# Altium project pyboardCN_V2.PrjPCB
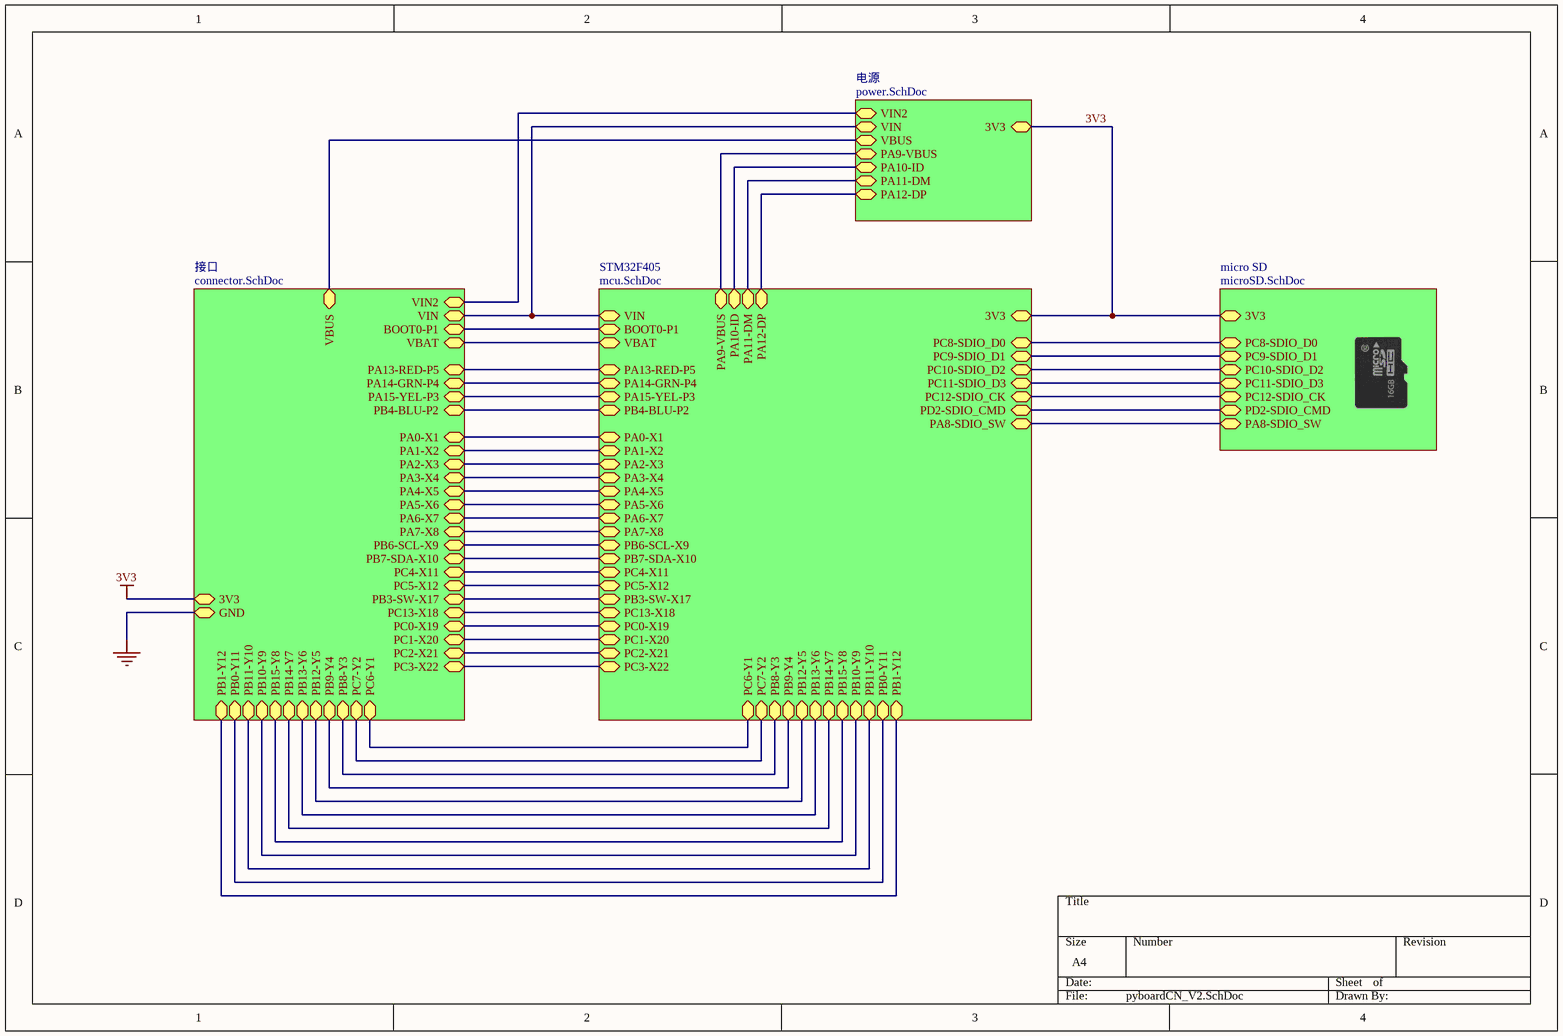
[diagram p0: pyboardCN_V2.SchDoc]
5 sheets, 62 parts. Net scope: hierarchical (ports join the sheet entries above them; power ports are global).
Board file: pyboardCN_V2.PcbDoc
Sheets:
  pyboardCN_V2.SchDoc
    STM32F405 = mcu.SchDoc
    接口 = connector.SchDoc
    电源 = power.SchDoc
    micro SD = microSD.SchDoc

## Sheet pyboardCN_V2.SchDoc
size A4

### Sub-sheets
micro SD = microSD.SchDoc: PC8-SDIO_D0, PC9-SDIO_D1, PC10-SDIO_D2, PC11-SDIO_D3, PC12-SDIO_CK, PD2-SDIO_CMD, PA8-SDIO_SW, 3V3
STM32F405 = mcu.SchDoc: PC8-SDIO_D0, PC9-SDIO_D1, PC10-SDIO_D2, PC11-SDIO_D3, PC12-SDIO_CK, PD2-SDIO_CMD, PA8-SDIO_SW, VIN, PA9-VBUS, PA10-ID, PA11-DM, PA12-DP, PA0-X1, PA1-X2, PA2-X3, PA3-X4, PA4-X5, PA5-X6, PA6-X7, PA7-X8, PB6-SCL-X9, PB7-SDA-X10, PC5-X12, PC4-X11, PB3-SW-X17, PC13-X18, PC0-X19, PC1-X20, PC2-X21, PC3-X22, PC6-Y1, PC7-Y2, PB8-Y3, PB9-Y4, PB12-Y5, PB13-Y6, PB14-Y7, PB15-Y8, PB10-Y9, PB11-Y10, PB0-Y11, PB1-Y12, BOOT0-P1, VBAT, PA13-RED-P5, PA14-GRN-P4, PA15-YEL-P3, PB4-BLU-P2, 3V3
接口 = connector.SchDoc: VIN, PC6-Y1, PC7-Y2, PB8-Y3, PB9-Y4, PB12-Y5, PB13-Y6, PB14-Y7, PB15-Y8, PB10-Y9, PB11-Y10, PB0-Y11, PB1-Y12, PA0-X1, PA1-X2, PA2-X3, PA3-X4, PA4-X5, PA5-X6, PA6-X7, PA7-X8, PB6-SCL-X9, PB7-SDA-X10, PC5-X12, PC4-X11, PB3-SW-X17, PC13-X18, PC0-X19, PC1-X20, PC2-X21, PC3-X22, BOOT0-P1, VBAT, PA13-RED-P5, PA14-GRN-P4, PA15-YEL-P3, PB4-BLU-P2, VIN2, 3V3, GND, VBUS
电源 = power.SchDoc: VIN, PA9-VBUS, PA10-ID, PA11-DM, PA12-DP, 3V3, VIN2, VBUS

### Nets
3V3: sheet STM32F405/3V3, sheet 接口/3V3, sheet 电源/3V3, sheet micro SD/3V3
VBUS: sheet 接口/VBUS, sheet 电源/VBUS
VIN: sheet STM32F405/VIN, sheet 接口/VIN, sheet 电源/VIN
BOOT0-P1: sheet STM32F405/BOOT0-P1, sheet 接口/BOOT0-P1
PA0-X1: sheet STM32F405/PA0-X1, sheet 接口/PA0-X1
PA1-X2: sheet STM32F405/PA1-X2, sheet 接口/PA1-X2
PA2-X3: sheet STM32F405/PA2-X3, sheet 接口/PA2-X3
PA3-X4: sheet STM32F405/PA3-X4, sheet 接口/PA3-X4
PA4-X5: sheet STM32F405/PA4-X5, sheet 接口/PA4-X5
PA5-X6: sheet STM32F405/PA5-X6, sheet 接口/PA5-X6
PA6-X7: sheet STM32F405/PA6-X7, sheet 接口/PA6-X7
PA7-X8: sheet STM32F405/PA7-X8, sheet 接口/PA7-X8
PA8-SDIO_SW: sheet STM32F405/PA8-SDIO_SW, sheet micro SD/PA8-SDIO_SW
PA9-VBUS: sheet STM32F405/PA9-VBUS, sheet 电源/PA9-VBUS
PA10-ID: sheet STM32F405/PA10-ID, sheet 电源/PA10-ID
PA11-DM: sheet STM32F405/PA11-DM, sheet 电源/PA11-DM
PA12-DP: sheet STM32F405/PA12-DP, sheet 电源/PA12-DP
PA13-RED-P5: sheet STM32F405/PA13-RED-P5, sheet 接口/PA13-RED-P5
PA14-GRN-P4: sheet STM32F405/PA14-GRN-P4, sheet 接口/PA14-GRN-P4
PA15-YEL-P3: sheet STM32F405/PA15-YEL-P3, sheet 接口/PA15-YEL-P3
PB0-Y11: sheet STM32F405/PB0-Y11, sheet 接口/PB0-Y11
PB1-Y12: sheet STM32F405/PB1-Y12, sheet 接口/PB1-Y12
PB3-SW-X17: sheet STM32F405/PB3-SW-X17, sheet 接口/PB3-SW-X17
PB4-BLU-P2: sheet STM32F405/PB4-BLU-P2, sheet 接口/PB4-BLU-P2
PB6-SCL-X9: sheet STM32F405/PB6-SCL-X9, sheet 接口/PB6-SCL-X9
PB7-SDA-X10: sheet STM32F405/PB7-SDA-X10, sheet 接口/PB7-SDA-X10
PB8-Y3: sheet STM32F405/PB8-Y3, sheet 接口/PB8-Y3
PB9-Y4: sheet STM32F405/PB9-Y4, sheet 接口/PB9-Y4
PB10-Y9: sheet STM32F405/PB10-Y9, sheet 接口/PB10-Y9
PB11-Y10: sheet STM32F405/PB11-Y10, sheet 接口/PB11-Y10
PB12-Y5: sheet STM32F405/PB12-Y5, sheet 接口/PB12-Y5
PB13-Y6: sheet STM32F405/PB13-Y6, sheet 接口/PB13-Y6
PB14-Y7: sheet STM32F405/PB14-Y7, sheet 接口/PB14-Y7
PB15-Y8: sheet STM32F405/PB15-Y8, sheet 接口/PB15-Y8
PC0-X19: sheet STM32F405/PC0-X19, sheet 接口/PC0-X19
PC1-X20: sheet STM32F405/PC1-X20, sheet 接口/PC1-X20
PC2-X21: sheet STM32F405/PC2-X21, sheet 接口/PC2-X21
PC3-X22: sheet STM32F405/PC3-X22, sheet 接口/PC3-X22
PC4-X11: sheet STM32F405/PC4-X11, sheet 接口/PC4-X11
PC5-X12: sheet STM32F405/PC5-X12, sheet 接口/PC5-X12
PC6-Y1: sheet STM32F405/PC6-Y1, sheet 接口/PC6-Y1
PC7-Y2: sheet STM32F405/PC7-Y2, sheet 接口/PC7-Y2
PC8-SDIO_D0: sheet STM32F405/PC8-SDIO_D0, sheet micro SD/PC8-SDIO_D0
PC9-SDIO_D1: sheet STM32F405/PC9-SDIO_D1, sheet micro SD/PC9-SDIO_D1
PC10-SDIO_D2: sheet STM32F405/PC10-SDIO_D2, sheet micro SD/PC10-SDIO_D2
PC11-SDIO_D3: sheet STM32F405/PC11-SDIO_D3, sheet micro SD/PC11-SDIO_D3
PC12-SDIO_CK: sheet STM32F405/PC12-SDIO_CK, sheet micro SD/PC12-SDIO_CK
PC13-X18: sheet STM32F405/PC13-X18, sheet 接口/PC13-X18
PD2-SDIO_CMD: sheet STM32F405/PD2-SDIO_CMD, sheet micro SD/PD2-SDIO_CMD
VBAT: sheet STM32F405/VBAT, sheet 接口/VBAT
VIN2: sheet 接口/VIN2, sheet 电源/VIN2

## Sheet mcu.SchDoc
size A3
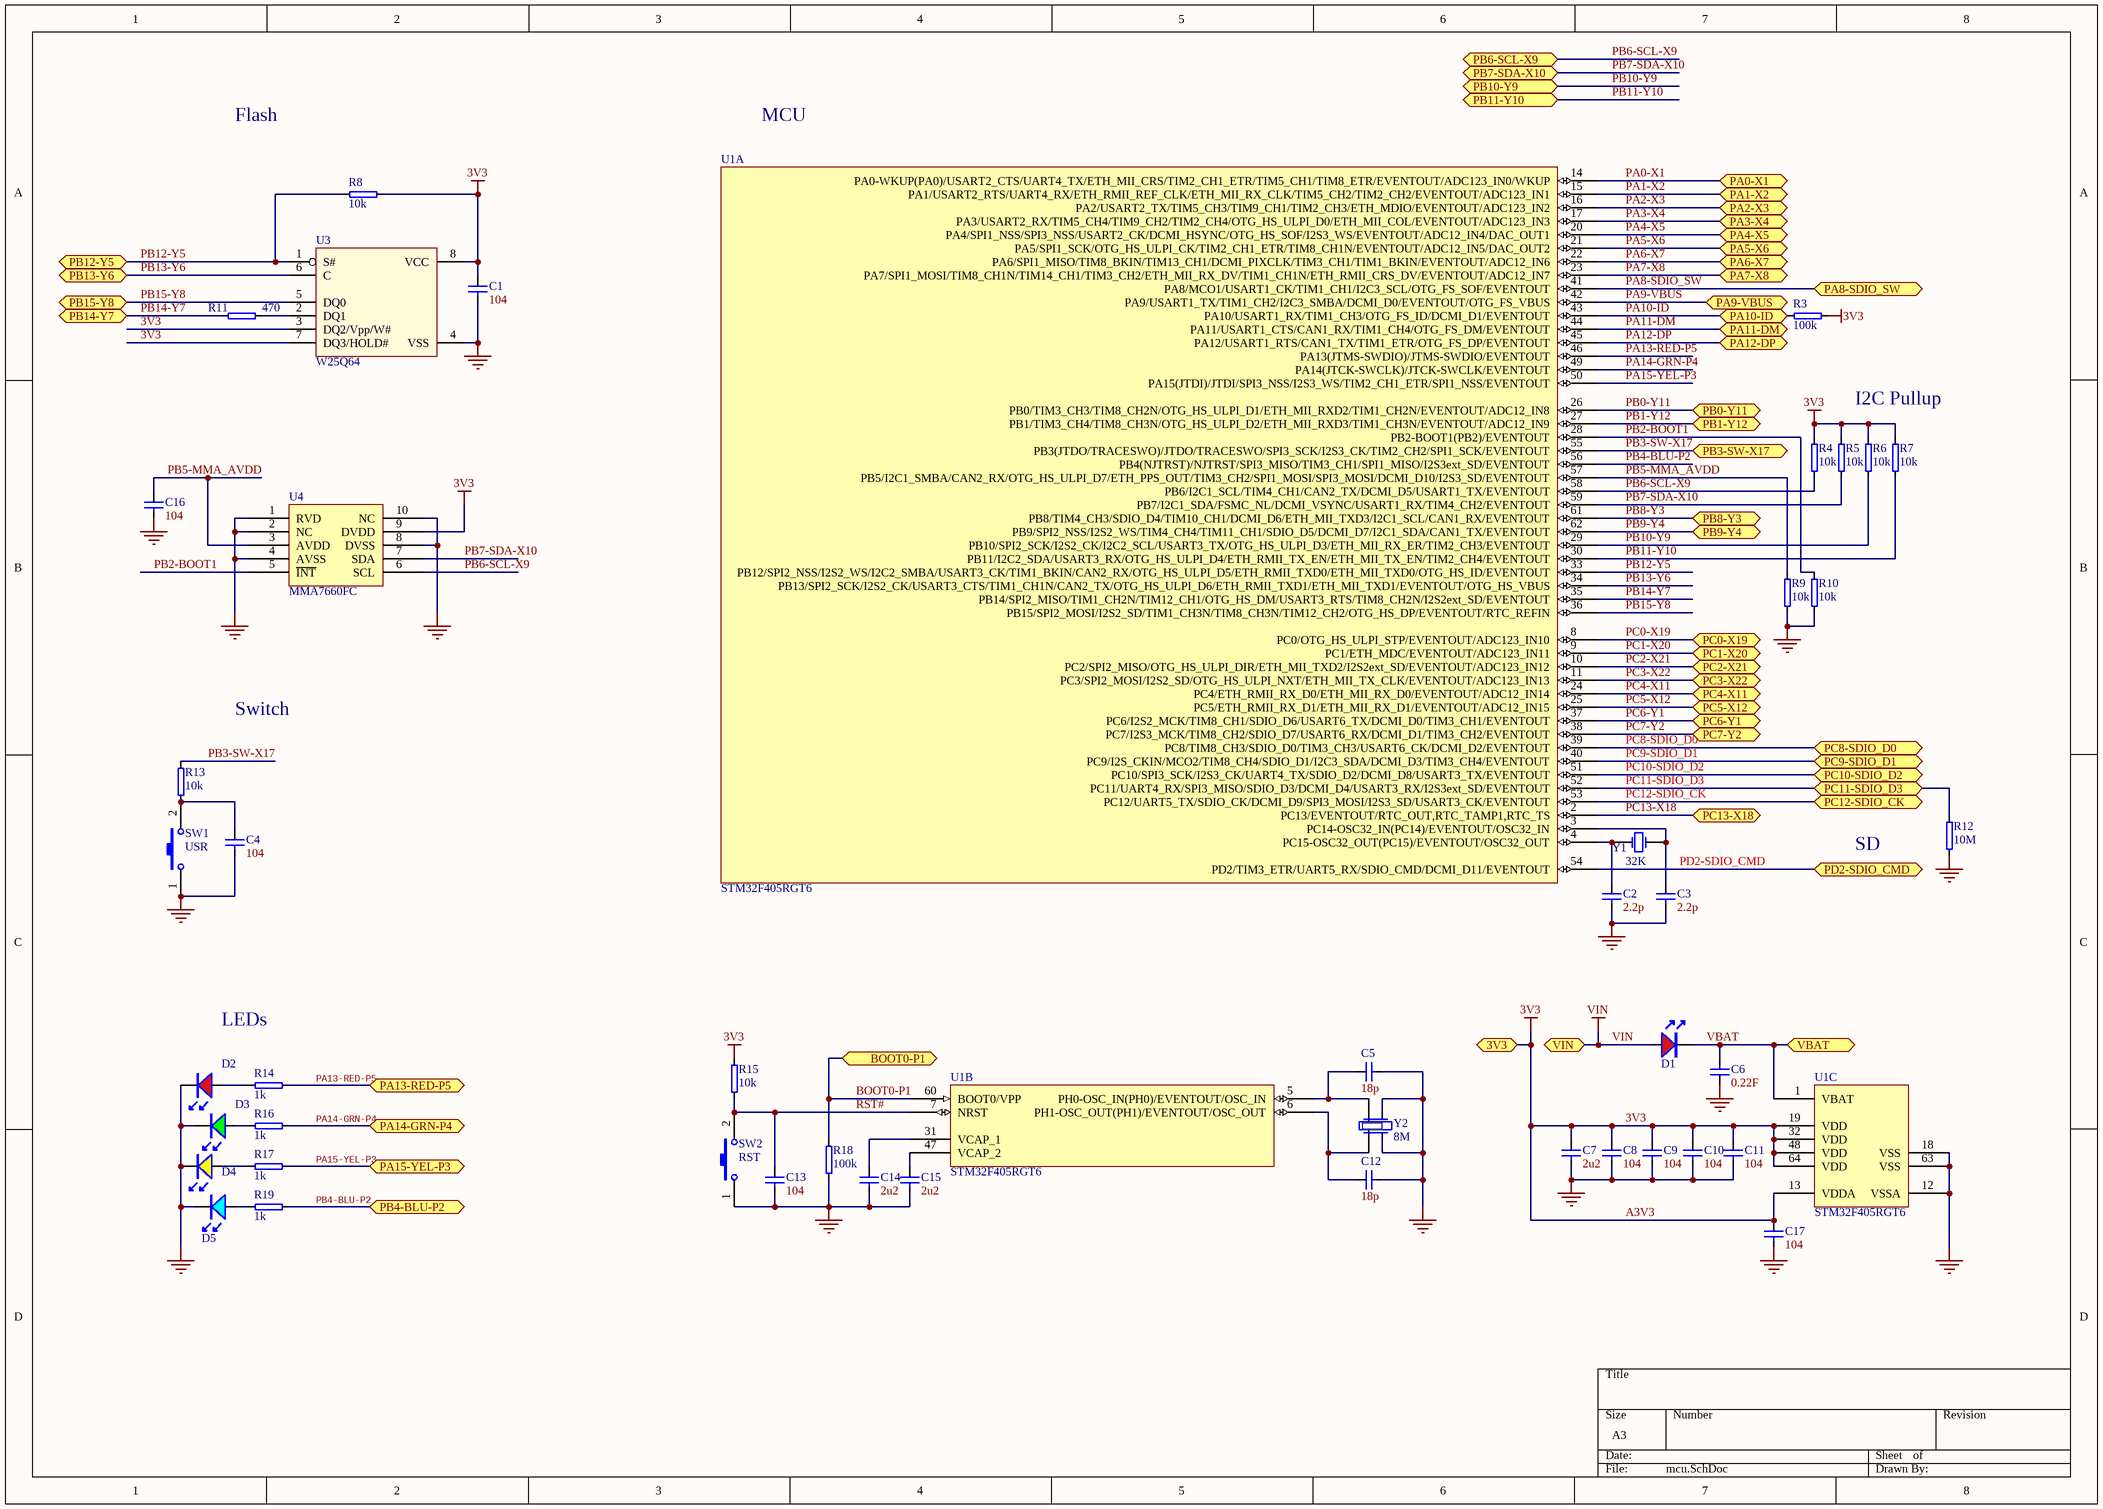
[diagram p1: mcu.SchDoc]

### Parts
C1  104  [SMD0402]
C2  2.2p  [SMD0402]
C3  2.2p  [SMD0402]
C4  104  [SMD0402]
C5  18p  [SMD0402]
C6  0.22F  [DMS3R3224R]
C7  2u2  [SMD0603]
C8  104  [SMD0402]
C9  104  [SMD0402]
C10  104  [SMD0402]
C11  104  [SMD0402]
C12  18p  [SMD0402]
C13  104  [SMD0402]
C14  2u2  [SMD0603]
C15  2u2  [SMD0603]
C16  104  [SMD0402]
C17  104  [SMD0402]
D1  LED RED  [LED_0603_RED]  (value not drawn)
D2  LED RED  [LED_0603_RED]  (value not drawn)
D3  LED GREEN  [LED_0603_GREEN]  (value not drawn)
D4  LED Yellow  [LED_0603_YELLOW]  (value not drawn)
D5  LED Blue  [LED_0603_BLUE]  (value not drawn)
R3  100k  [SMD0402]
R4  10k  [SMD0402]
R5  10k  [SMD0402]
R6  10k  [SMD0402]
R7  10k  [SMD0402]
R8  10k  [SMD0402]
R9  10k  [SMD0402]
R10  10k  [SMD0402]
R11  470  [SMD0402]
R12  10M  [SMD0402]
R13  10k  [SMD0402]
R14  1k  [SMD0402]
R15  10k  [SMD0402]
R16  1k  [SMD0402]
R17  1k  [SMD0402]
R18  100k  [SMD0402]
R19  1k  [SMD0402]
SW1  USR  [SWPB_2x4_L]
SW2  RST  [SWPB_2x4_L]
U1  STM32F405RGT6  [LQFP64_M]  (parts A,B,C of 3)
U3  W25Q64  [SO8_L]
U4  MMA7660FC  [MMA7660]
Y1  32K  [TXC_9H03200019]
Y2  8M  [SMD3225]

### Ports
3V3, BOOT0-P1, PA0-X1, PA1-X2, PA2-X3, PA3-X4, PA4-X5, PA5-X6, PA6-X7, PA7-X8, PA8-SDIO_SW, PA9-VBUS, PA10-ID, PA11-DM, PA12-DP, PA13-RED-P5, PA14-GRN-P4, PA15-YEL-P3, PB0-Y11, PB1-Y12, PB3-SW-X17, PB4-BLU-P2, PB6-SCL-X9, PB7-SDA-X10, PB8-Y3, PB9-Y4, PB10-Y9, PB11-Y10, PB12-Y5, PB13-Y6, PB14-Y7, PB15-Y8, PC0-X19, PC1-X20, PC2-X21, PC3-X22, PC4-X11, PC5-X12, PC6-Y1, PC7-Y2, PC8-SDIO_D0, PC9-SDIO_D1, PC10-SDIO_D2, PC11-SDIO_D3, PC12-SDIO_CK, PC13-X18, PD2-SDIO_CMD, VBAT, VIN

### Nets
3V3: C1.2 C7.2 C8.2 C9.2 C10.2 C11.2 C17.2 R3.1 R4.1 R5.1 R6.1 R7.1 R8.1 R15.2 U1.13(VDDA) U1.19(VDD) U1.32(VDD) U1.48(VDD) U1.64(VDD) U3.3(DQ2/Vpp/W#) U3.7(DQ3/HOLD#) U3.8(VCC) U4.9(DVDD) ; port 3V3  [also labelled A3V3]
GND: C1.1 C2.1 C3.1 C4.1 C5.1 C6.2 C7.1 C8.1 C9.1 C10.1 C11.1 C12.1 C13.1 C14.1 C15.1 C16.1 C17.1 D2.2 D3.2 D4.2 D5.2 R9.2 R10.2 R12.2 R18.1 SW1.1 SW2.1 U1.12(VSSA) U1.18(VSS) U1.63(VSS) U3.4(VSS) U4.1(RVD) U4.2(NC) U4.4(AVSS) U4.8(DVSS) U4.10(NC) Y2.2(GND) Y2.4(GND)
VIN: D1.1 ; port VIN
BOOT0-P1: R18.2 U1.60(BOOT0/VPP) ; port BOOT0-P1
PA0-X1: U1.14(PA0-WKUP(PA0)/USART2_CTS/UART4_TX/ETH_MII_CRS/TIM2_CH1_ETR/TIM5_CH1/TIM8_ETR/EVENTOUT/ADC123_IN0/WKUP) ; port PA0-X1
PA1-X2: U1.15(PA1/USART2_RTS/UART4_RX/ETH_RMII_REF_CLK/ETH_MII_RX_CLK/TIM5_CH2/TIM2_CH2/EVENTOUT/ADC123_IN1) ; port PA1-X2
PA2-X3: U1.16(PA2/USART2_TX/TIM5_CH3/TIM9_CH1/TIM2_CH3/ETH_MDIO/EVENTOUT/ADC123_IN2) ; port PA2-X3
PA3-X4: U1.17(PA3/USART2_RX/TIM5_CH4/TIM9_CH2/TIM2_CH4/OTG_HS_ULPI_D0/ETH_MII_COL/EVENTOUT/ADC123_IN3) ; port PA3-X4
PA4-X5: U1.20(PA4/SPI1_NSS/SPI3_NSS/USART2_CK/DCMI_HSYNC/OTG_HS_SOF/I2S3_WS/EVENTOUT/ADC12_IN4/DAC_OUT1) ; port PA4-X5
PA5-X6: U1.21(PA5/SPI1_SCK/OTG_HS_ULPI_CK/TIM2_CH1_ETR/TIM8_CH1N/EVENTOUT/ADC12_IN5/DAC_OUT2) ; port PA5-X6
PA6-X7: U1.22(PA6/SPI1_MISO/TIM8_BKIN/TIM13_CH1/DCMI_PIXCLK/TIM3_CH1/TIM1_BKIN/EVENTOUT/ADC12_IN6) ; port PA6-X7
PA7-X8: U1.23(PA7/SPI1_MOSI/TIM8_CH1N/TIM14_CH1/TIM3_CH2/ETH_MII_RX_DV/TIM1_CH1N/ETH_RMII_CRS_DV/EVENTOUT/ADC12_IN7) ; port PA7-X8
PA8-SDIO_SW: U1.41(PA8/MCO1/USART1_CK/TIM1_CH1/I2C3_SCL/OTG_FS_SOF/EVENTOUT) ; port PA8-SDIO_SW
PA9-VBUS: U1.42(PA9/USART1_TX/TIM1_CH2/I2C3_SMBA/DCMI_D0/EVENTOUT/OTG_FS_VBUS) ; port PA9-VBUS
PA10-ID: R3.2 U1.43(PA10/USART1_RX/TIM1_CH3/OTG_FS_ID/DCMI_D1/EVENTOUT) ; port PA10-ID
PA11-DM: U1.44(PA11/USART1_CTS/CAN1_RX/TIM1_CH4/OTG_FS_DM/EVENTOUT) ; port PA11-DM
PA12-DP: U1.45(PA12/USART1_RTS/CAN1_TX/TIM1_ETR/OTG_FS_DP/EVENTOUT) ; port PA12-DP
PA13-RED-P5: R14.1 U1.46(PA13(JTMS-SWDIO)/JTMS-SWDIO/EVENTOUT) ; port PA13-RED-P5
PA14-GRN-P4: R16.1 U1.49(PA14(JTCK-SWCLK)/JTCK-SWCLK/EVENTOUT) ; port PA14-GRN-P4
PA15-YEL-P3: R17.1 U1.50(PA15(JTDI)/JTDI/SPI3_NSS/I2S3_WS/TIM2_CH1_ETR/SPI1_NSS/EVENTOUT) ; port PA15-YEL-P3
PB0-Y11: U1.26(PB0/TIM3_CH3/TIM8_CH2N/OTG_HS_ULPI_D1/ETH_MII_RXD2/TIM1_CH2N/EVENTOUT/ADC12_IN8) ; port PB0-Y11
PB1-Y12: U1.27(PB1/TIM3_CH4/TIM8_CH3N/OTG_HS_ULPI_D2/ETH_MII_RXD3/TIM1_CH3N/EVENTOUT/ADC12_IN9) ; port PB1-Y12
PB2-BOOT1: R10.1 U1.28(PB2-BOOT1(PB2)/EVENTOUT) U4.5(~{INT})
PB3-SW-X17: R13.2 U1.55(PB3(JTDO/TRACESWO)/JTDO/TRACESWO/SPI3_SCK/I2S3_CK/TIM2_CH2/SPI1_SCK/EVENTOUT) ; port PB3-SW-X17
PB4-BLU-P2: R19.1 U1.56(PB4(NJTRST)/NJTRST/SPI3_MISO/TIM3_CH1/SPI1_MISO/I2S3ext_SD/EVENTOUT) ; port PB4-BLU-P2
PB5-MMA_AVDD: C16.2 R9.1 U1.57(PB5/I2C1_SMBA/CAN2_RX/OTG_HS_ULPI_D7/ETH_PPS_OUT/TIM3_CH2/SPI1_MOSI/SPI3_MOSI/DCMI_D10/I2S3_SD/EVENTOUT) U4.3(AVDD)
PB6-SCL-X9: R4.2 U1.58(PB6/I2C1_SCL/TIM4_CH1/CAN2_TX/DCMI_D5/USART1_TX/EVENTOUT) U4.6(SCL) ; port PB6-SCL-X9
PB7-SDA-X10: R5.2 U1.59(PB7/I2C1_SDA/FSMC_NL/DCMI_VSYNC/USART1_RX/TIM4_CH2/EVENTOUT) U4.7(SDA) ; port PB7-SDA-X10
PB8-Y3: U1.61(PB8/TIM4_CH3/SDIO_D4/TIM10_CH1/DCMI_D6/ETH_MII_TXD3/I2C1_SCL/CAN1_RX/EVENTOUT) ; port PB8-Y3
PB9-Y4: U1.62(PB9/SPI2_NSS/I2S2_WS/TIM4_CH4/TIM11_CH1/SDIO_D5/DCMI_D7/I2C1_SDA/CAN1_TX/EVENTOUT) ; port PB9-Y4
PB10-Y9: R6.2 U1.29(PB10/SPI2_SCK/I2S2_CK/I2C2_SCL/USART3_TX/OTG_HS_ULPI_D3/ETH_MII_RX_ER/TIM2_CH3/EVENTOUT) ; port PB10-Y9
PB11-Y10: R7.2 U1.30(PB11/I2C2_SDA/USART3_RX/OTG_HS_ULPI_D4/ETH_RMII_TX_EN/ETH_MII_TX_EN/TIM2_CH4/EVENTOUT) ; port PB11-Y10
PB12-Y5: R8.2 U1.33(PB12/SPI2_NSS/I2S2_WS/I2C2_SMBA/USART3_CK/TIM1_BKIN/CAN2_RX/OTG_HS_ULPI_D5/ETH_RMII_TXD0/ETH_MII_TXD0/OTG_HS_ID/EVENTOUT) U3.1(S#) ; port PB12-Y5
PB13-Y6: U1.34(PB13/SPI2_SCK/I2S2_CK/USART3_CTS/TIM1_CH1N/CAN2_TX/OTG_HS_ULPI_D6/ETH_RMII_TXD1/ETH_MII_TXD1/EVENTOUT/OTG_HS_VBUS) U3.6(C) ; port PB13-Y6
PB14-Y7: R11.2 U1.35(PB14/SPI2_MISO/TIM1_CH2N/TIM12_CH1/OTG_HS_DM/USART3_RTS/TIM8_CH2N/I2S2ext_SD/EVENTOUT) ; port PB14-Y7
PB15-Y8: U1.36(PB15/SPI2_MOSI/I2S2_SD/TIM1_CH3N/TIM8_CH3N/TIM12_CH2/OTG_HS_DP/EVENTOUT/RTC_REFIN) U3.5(DQ0) ; port PB15-Y8
PC0-X19: U1.8(PC0/OTG_HS_ULPI_STP/EVENTOUT/ADC123_IN10) ; port PC0-X19
PC1-X20: U1.9(PC1/ETH_MDC/EVENTOUT/ADC123_IN11) ; port PC1-X20
PC2-X21: U1.10(PC2/SPI2_MISO/OTG_HS_ULPI_DIR/ETH_MII_TXD2/I2S2ext_SD/EVENTOUT/ADC123_IN12) ; port PC2-X21
PC3-X22: U1.11(PC3/SPI2_MOSI/I2S2_SD/OTG_HS_ULPI_NXT/ETH_MII_TX_CLK/EVENTOUT/ADC123_IN13) ; port PC3-X22
PC4-X11: U1.24(PC4/ETH_RMII_RX_D0/ETH_MII_RX_D0/EVENTOUT/ADC12_IN14) ; port PC4-X11
PC5-X12: U1.25(PC5/ETH_RMII_RX_D1/ETH_MII_RX_D1/EVENTOUT/ADC12_IN15) ; port PC5-X12
PC6-Y1: U1.37(PC6/I2S2_MCK/TIM8_CH1/SDIO_D6/USART6_TX/DCMI_D0/TIM3_CH1/EVENTOUT) ; port PC6-Y1
PC7-Y2: U1.38(PC7/I2S3_MCK/TIM8_CH2/SDIO_D7/USART6_RX/DCMI_D1/TIM3_CH2/EVENTOUT) ; port PC7-Y2
PC8-SDIO_D0: U1.39(PC8/TIM8_CH3/SDIO_D0/TIM3_CH3/USART6_CK/DCMI_D2/EVENTOUT) ; port PC8-SDIO_D0
PC9-SDIO_D1: U1.40(PC9/I2S_CKIN/MCO2/TIM8_CH4/SDIO_D1/I2C3_SDA/DCMI_D3/TIM3_CH4/EVENTOUT) ; port PC9-SDIO_D1
PC10-SDIO_D2: U1.51(PC10/SPI3_SCK/I2S3_CK/UART4_TX/SDIO_D2/DCMI_D8/USART3_TX/EVENTOUT) ; port PC10-SDIO_D2
PC11-SDIO_D3: R12.1 U1.52(PC11/UART4_RX/SPI3_MISO/SDIO_D3/DCMI_D4/USART3_RX/I2S3ext_SD/EVENTOUT) ; port PC11-SDIO_D3
PC12-SDIO_CK: U1.53(PC12/UART5_TX/SDIO_CK/DCMI_D9/SPI3_MOSI/I2S3_SD/USART3_CK/EVENTOUT) ; port PC12-SDIO_CK
PC13-X18: U1.2(PC13/EVENTOUT/RTC_OUT,RTC_TAMP1,RTC_TS) ; port PC13-X18
PD2-SDIO_CMD: U1.54(PD2/TIM3_ETR/UART5_RX/SDIO_CMD/DCMI_D11/EVENTOUT) ; port PD2-SDIO_CMD
RST#: C13.2 R15.1 SW2.2 U1.7(NRST)
VBAT: C6.1 D1.2 U1.1(VBAT) ; port VBAT
NetC2_2: C2.2 U1.4(PC15-OSC32_OUT(PC15)/EVENTOUT/OSC32_OUT) Y1.1(OSC1)
NetC3_2: C3.2 U1.3(PC14-OSC32_IN(PC14)/EVENTOUT/OSC32_IN) Y1.2(OSC2)
NetC4_2: C4.2 R13.1 SW1.2
NetC5_2: C5.2 U1.5(PH0-OSC_IN(PH0)/EVENTOUT/OSC_IN) Y2.3(OSC2)
NetC12_2: C12.2 U1.6(PH1-OSC_OUT(PH1)/EVENTOUT/OSC_OUT) Y2.1(OSC1)
NetC14_2: C14.2 U1.31(VCAP_1)
NetC15_2: C15.2 U1.47(VCAP_2)
NetD2_1: D2.1 R14.2
NetD3_1: D3.1 R16.2
NetD4_1: D4.1 R17.2
NetD5_1: D5.1 R19.2
NetR11_1: R11.1 U3.2(DQ1)

### Notes on the sheet
- Flash
- MCU
- I2C Pullup
- (near R13) Switch
- SD
- LEDs

### Library data of the parts
C1-C17 = Cap
D1 D2 = LED-RED: 红色发光二极管
D3 = LED-GREEN: 绿色发光二极管
D4 = LED-YELLOW: 黄色发光二极管
D5 = LED-BLUE: 蓝色发光二极管
R3-R19 = Res
SW1 SW2 = SW-PB: Switch; Published: 24-Mar-1999; LatestRevisionDate: 17-Jul-2002; LatestRevisionNote: Re-released for DXP Platform.; PackageReference: SPST-2; Publisher: Altium Limited; PackageDescription: Switch; 2 Leads
U3 = N25Q128A13EF840E: 128Mb, 3V, Multiple I/O Serial Flash Memory, Quad/Dual; Manuf_1: MICRON; Manuf_Part_2: N25Q256A13EF840E; Manuf_Part_3: N25Q512A13EF840E; ECCN_US/EU: 3A991/NEC; Order: N25Q128A13EF840F-ND; Provided: ST; Ref St: 9171973; Manuf_Part_1: N25Q128A13EF840E; Distrib: MICRON
U4 = MMA7660
Y1 = XTAL
Y2 = XTAL_SMD

## Sheet connector.SchDoc
size A4
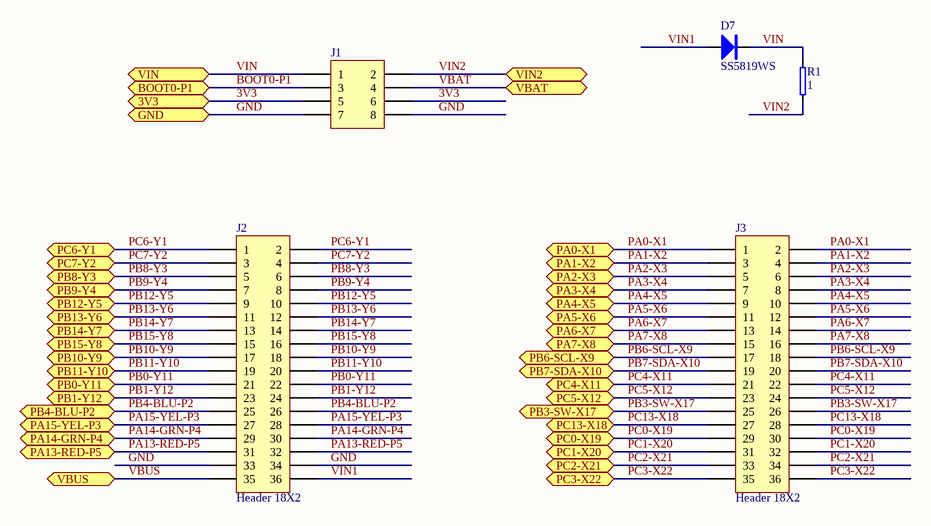
[diagram p2: connector.SchDoc]

### Parts
D7  SS5819WS  [1N5819-SOD323]
J1  (no value)  [HDR2X4]
J2  Header 18X2  [HDR2X18]
J3  Header 18X2  [HDR2X18]
R1  1  [SMD0402]

### Ports
3V3, BOOT0-P1, GND, PA0-X1, PA1-X2, PA2-X3, PA3-X4, PA4-X5, PA5-X6, PA6-X7, PA7-X8, PA13-RED-P5, PA14-GRN-P4, PA15-YEL-P3, PB0-Y11, PB1-Y12, PB3-SW-X17, PB4-BLU-P2, PB6-SCL-X9, PB7-SDA-X10, PB8-Y3, PB9-Y4, PB10-Y9, PB11-Y10, PB12-Y5, PB13-Y6, PB14-Y7, PB15-Y8, PC0-X19, PC1-X20, PC2-X21, PC3-X22, PC4-X11, PC5-X12, PC6-Y1, PC7-Y2, PC13-X18, VBAT, VBUS, VIN, VIN2

### Nets
3V3: J1.5 J1.6 ; port 3V3
GND: J1.7 J1.8 J2.33 J2.34 ; port GND
VBUS: J2.35 ; port VBUS
VIN: D7.2 J1.1 R1.1 ; port VIN
BOOT0-P1: J1.3 ; port BOOT0-P1
PA0-X1: J3.1 J3.2 ; port PA0-X1
PA1-X2: J3.3 J3.4 ; port PA1-X2
PA2-X3: J3.5 J3.6 ; port PA2-X3
PA3-X4: J3.7 J3.8 ; port PA3-X4
PA4-X5: J3.9 J3.10 ; port PA4-X5
PA5-X6: J3.11 J3.12 ; port PA5-X6
PA6-X7: J3.13 J3.14 ; port PA6-X7
PA7-X8: J3.15 J3.16 ; port PA7-X8
PA13-RED-P5: J2.31 J2.32 ; port PA13-RED-P5
PA14-GRN-P4: J2.29 J2.30 ; port PA14-GRN-P4
PA15-YEL-P3: J2.27 J2.28 ; port PA15-YEL-P3
PB0-Y11: J2.21 J2.22 ; port PB0-Y11
PB1-Y12: J2.23 J2.24 ; port PB1-Y12
PB3-SW-X17: J3.25 J3.26 ; port PB3-SW-X17
PB4-BLU-P2: J2.25 J2.26 ; port PB4-BLU-P2
PB6-SCL-X9: J3.17 J3.18 ; port PB6-SCL-X9
PB7-SDA-X10: J3.19 J3.20 ; port PB7-SDA-X10
PB8-Y3: J2.5 J2.6 ; port PB8-Y3
PB9-Y4: J2.7 J2.8 ; port PB9-Y4
PB10-Y9: J2.17 J2.18 ; port PB10-Y9
PB11-Y10: J2.19 J2.20 ; port PB11-Y10
PB12-Y5: J2.9 J2.10 ; port PB12-Y5
PB13-Y6: J2.11 J2.12 ; port PB13-Y6
PB14-Y7: J2.13 J2.14 ; port PB14-Y7
PB15-Y8: J2.15 J2.16 ; port PB15-Y8
PC0-X19: J3.29 J3.30 ; port PC0-X19
PC1-X20: J3.31 J3.32 ; port PC1-X20
PC2-X21: J3.33 J3.34 ; port PC2-X21
PC3-X22: J3.35 J3.36 ; port PC3-X22
PC4-X11: J3.21 J3.22 ; port PC4-X11
PC5-X12: J3.23 J3.24 ; port PC5-X12
PC6-Y1: J2.1 J2.2 ; port PC6-Y1
PC7-Y2: J2.3 J2.4 ; port PC7-Y2
PC13-X18: J3.27 J3.28 ; port PC13-X18
VBAT: J1.4 ; port VBAT
VIN1: D7.1 J2.36
VIN2: J1.2 R1.2 ; port VIN2

### Library data of the parts
D7 = Diode
J1 = Header 4X2: Header, 4-Pin, Dual row; LatestRevisionDate: 17-Jul-2002; LatestRevisionNote: Re-released for DXP Platform.; Publisher: Altium Limited
J2 J3 = Header 18X2: Header, 18-Pin, Dual row; LatestRevisionDate: 17-Jul-2002; LatestRevisionNote: Re-released for DXP Platform.; Publisher: Altium Limited
R1 = Res

## Sheet power.SchDoc
size A4
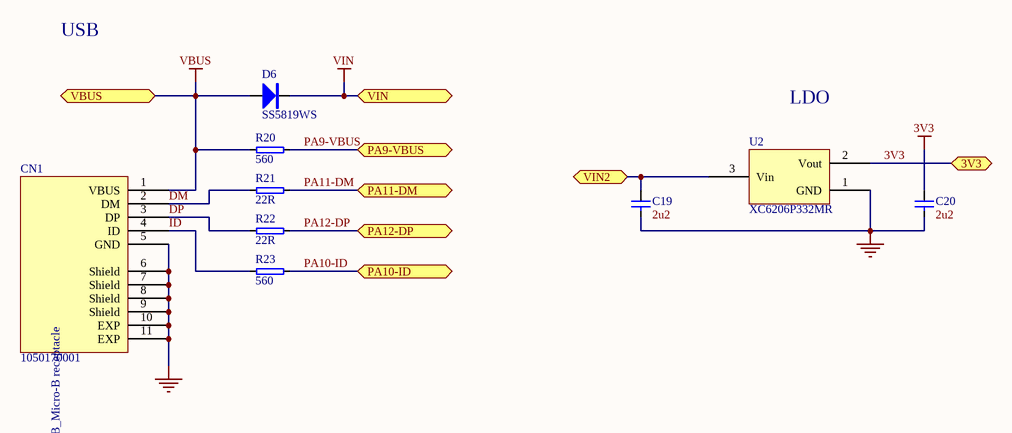
[diagram p3: power.SchDoc]

### Parts
C19  2u2  [SMD0603]
C20  2u2  [SMD0603]
CN1  1050170001  [MOLEX_1050170001]
D6  SS5819WS  [1N5819-SOD323]
R20  560  [SMD0402]
R21  22R  [SMD0402]
R22  22R  [SMD0402]
R23  560  [SMD0402]
U2  XC6206P332MR  [SOT-23_N]

### Ports
3V3, PA9-VBUS, PA10-ID, PA11-DM, PA12-DP, VBUS, VIN, VIN2

### Nets
3V3: C20.2 U2.2(Vout) ; port 3V3
GND: C19.1 C20.1 CN1.5(GND) CN1.6(Shield) CN1.7(Shield) CN1.8(Shield) CN1.9(Shield) CN1.10(EXP) CN1.11(EXP) U2.1(GND)
VBUS: CN1.1(VBUS) D6.1 R20.2 ; port VBUS
VIN: D6.2 ; port VIN
DM: CN1.2(DM) R21.2
DP: CN1.3(DP) R22.2
ID: CN1.4(ID) R23.2
PA9-VBUS: R20.1 ; port PA9-VBUS
PA10-ID: R23.1 ; port PA10-ID
PA11-DM: R21.1 ; port PA11-DM
PA12-DP: R22.1 ; port PA12-DP
VIN2: C19.2 U2.3(Vin) ; port VIN2

### Notes on the sheet
- USB
- LDO
- (in symbol 1050170001) USB_Micro-B receptacle

### Library data of the parts
C19 C20 = Cap
CN1 = 1050170001: Silkscreen: USB
D6 = Diode
R20-R23 = Res
U2 = XC6206

## Sheet microSD.SchDoc
size A4
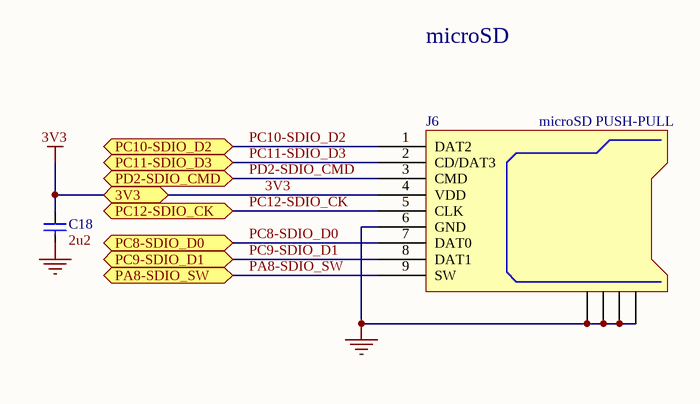
[diagram p4: microSD.SchDoc]

### Parts
C18  2u2  [SMD0603]
J6  microSD PUSH-PULL  [microSD-1]

### Ports
3V3, PA8-SDIO_SW, PC8-SDIO_D0, PC9-SDIO_D1, PC10-SDIO_D2, PC11-SDIO_D3, PC12-SDIO_CK, PD2-SDIO_CMD

### Nets
3V3: C18.2 J6.4(VDD) ; port 3V3
GND: C18.1 J6.6(GND) J6.GP1 J6.GP2 J6.GP3 J6.GP4
PA8-SDIO_SW: J6.9(SW) ; port PA8-SDIO_SW
PC8-SDIO_D0: J6.7(DAT0) ; port PC8-SDIO_D0
PC9-SDIO_D1: J6.8(DAT1) ; port PC9-SDIO_D1
PC10-SDIO_D2: J6.1(DAT2) ; port PC10-SDIO_D2
PC11-SDIO_D3: J6.2(CD/DAT3) ; port PC11-SDIO_D3
PC12-SDIO_CK: J6.5(CLK) ; port PC12-SDIO_CK
PD2-SDIO_CMD: J6.3(CMD) ; port PD2-SDIO_CMD

### Notes on the sheet
- microSD

### Library data of the parts
C18 = Cap

## Nets that join several sheets
3V3: mcu (23 pins), connector (J1.5 J1.6), power (C20.2 U2.2), microSD (C18.2 J6.4)
GND: mcu (38 pins), connector (J1.7 J1.8 J2.33 J2.34), power (10 pins), microSD (6 pins)
VBUS: connector (J2.35), power (CN1.1 D6.1 R20.2)
VIN: mcu (D1.1), connector (D7.2 J1.1 R1.1), power (D6.2)
BOOT0-P1: mcu (R18.2 U1.60), connector (J1.3)
PA0-X1: mcu (U1.14), connector (J3.1 J3.2)
PA1-X2: mcu (U1.15), connector (J3.3 J3.4)
PA2-X3: mcu (U1.16), connector (J3.5 J3.6)
PA3-X4: mcu (U1.17), connector (J3.7 J3.8)
PA4-X5: mcu (U1.20), connector (J3.9 J3.10)
PA5-X6: mcu (U1.21), connector (J3.11 J3.12)
PA6-X7: mcu (U1.22), connector (J3.13 J3.14)
PA7-X8: mcu (U1.23), connector (J3.15 J3.16)
PA8-SDIO_SW: mcu (U1.41), microSD (J6.9)
PA9-VBUS: mcu (U1.42), power (R20.1)
PA10-ID: mcu (R3.2 U1.43), power (R23.1)
PA11-DM: mcu (U1.44), power (R21.1)
PA12-DP: mcu (U1.45), power (R22.1)
PA13-RED-P5: mcu (R14.1 U1.46), connector (J2.31 J2.32)
PA14-GRN-P4: mcu (R16.1 U1.49), connector (J2.29 J2.30)
PA15-YEL-P3: mcu (R17.1 U1.50), connector (J2.27 J2.28)
PB0-Y11: mcu (U1.26), connector (J2.21 J2.22)
PB1-Y12: mcu (U1.27), connector (J2.23 J2.24)
PB3-SW-X17: mcu (R13.2 U1.55), connector (J3.25 J3.26)
PB4-BLU-P2: mcu (R19.1 U1.56), connector (J2.25 J2.26)
PB6-SCL-X9: mcu (R4.2 U1.58 U4.6), connector (J3.17 J3.18)
PB7-SDA-X10: mcu (R5.2 U1.59 U4.7), connector (J3.19 J3.20)
PB8-Y3: mcu (U1.61), connector (J2.5 J2.6)
PB9-Y4: mcu (U1.62), connector (J2.7 J2.8)
PB10-Y9: mcu (R6.2 U1.29), connector (J2.17 J2.18)
PB11-Y10: mcu (R7.2 U1.30), connector (J2.19 J2.20)
PB12-Y5: mcu (R8.2 U1.33 U3.1), connector (J2.9 J2.10)
PB13-Y6: mcu (U1.34 U3.6), connector (J2.11 J2.12)
PB14-Y7: mcu (R11.2 U1.35), connector (J2.13 J2.14)
PB15-Y8: mcu (U1.36 U3.5), connector (J2.15 J2.16)
PC0-X19: mcu (U1.8), connector (J3.29 J3.30)
PC1-X20: mcu (U1.9), connector (J3.31 J3.32)
PC2-X21: mcu (U1.10), connector (J3.33 J3.34)
PC3-X22: mcu (U1.11), connector (J3.35 J3.36)
PC4-X11: mcu (U1.24), connector (J3.21 J3.22)
PC5-X12: mcu (U1.25), connector (J3.23 J3.24)
PC6-Y1: mcu (U1.37), connector (J2.1 J2.2)
PC7-Y2: mcu (U1.38), connector (J2.3 J2.4)
PC8-SDIO_D0: mcu (U1.39), microSD (J6.7)
PC9-SDIO_D1: mcu (U1.40), microSD (J6.8)
PC10-SDIO_D2: mcu (U1.51), microSD (J6.1)
PC11-SDIO_D3: mcu (R12.1 U1.52), microSD (J6.2)
PC12-SDIO_CK: mcu (U1.53), microSD (J6.5)
PC13-X18: mcu (U1.2), connector (J3.27 J3.28)
PD2-SDIO_CMD: mcu (U1.54), microSD (J6.3)
VBAT: mcu (C6.1 D1.2 U1.1), connector (J1.4)
VIN2: connector (J1.2 R1.2), power (C19.2 U2.3)